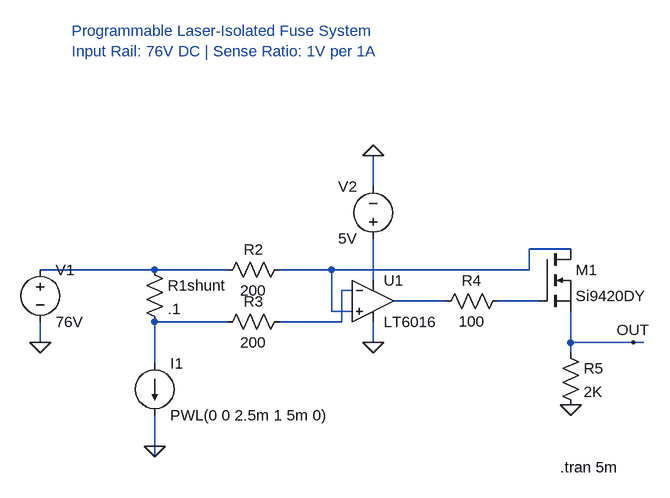
[diagram p0: schematic Project1_76V_Fuse.asc]
Project1_76V_Fuse.asc, the LTspice schematic file:
Version 4
SHEET 1 1008 800
WIRE 480 160 480 112
WIRE 784 256 720 256
WIRE 144 288 -32 288
WIRE 256 288 144 288
WIRE 416 288 336 288
WIRE 720 288 720 256
WIRE 720 288 416 288
WIRE 480 304 480 240
WIRE 448 320 432 320
WIRE 592 336 512 336
WIRE 736 336 672 336
WIRE 416 352 416 288
WIRE 448 352 416 352
WIRE 256 368 144 368
WIRE 432 368 432 320
WIRE 432 368 336 368
WIRE -32 400 -32 368
WIRE 480 400 480 368
WIRE 784 400 784 352
WIRE 880 400 784 400
WIRE 896 400 880 400
WIRE 784 416 784 400
WIRE 144 432 144 368
WIRE 144 560 144 512
WIRE 144 576 144 560
FLAG -32 400 0
FLAG 144 560 0
FLAG 480 400 0
FLAG 480 112 0
FLAG 880 400 OUT
FLAG 784 496 0
SYMBOL voltage -32 272 R0
SYMATTR InstName V1
SYMATTR Value 76V
SYMBOL res 128 272 R0
SYMATTR InstName R1shunt
SYMATTR Value .1
SYMBOL res 352 272 R90
WINDOW 0 0 56 VBottom 2
WINDOW 3 32 56 VTop 2
SYMATTR InstName R2
SYMATTR Value 200
SYMBOL res 352 352 R90
WINDOW 0 0 56 VBottom 2
WINDOW 3 32 56 VTop 2
SYMATTR InstName R3
SYMATTR Value 200
SYMBOL load2 144 432 R0
SYMATTR InstName I1
SYMATTR Value PWL(0 0 2.5m 1 5m 0)
SYMBOL OpAmps/LT6016 480 336 R0
SYMATTR InstName U1
SYMBOL voltage 480 256 R180
WINDOW 0 24 96 Left 2
WINDOW 3 24 16 Left 2
SYMATTR InstName V2
SYMATTR Value 5V
SYMBOL res 576 352 R270
WINDOW 0 32 56 VTop 2
WINDOW 3 0 56 VBottom 2
SYMATTR InstName R4
SYMATTR Value 100
SYMBOL nmos 736 256 R0
SYMATTR InstName M1
SYMATTR Value Si9420DY
SYMBOL res 768 400 R0
SYMATTR InstName R5
SYMATTR Value 2K
TEXT 768 592 Left 2 !.tran 5m
TEXT 16 -80 Left 2 ;Programmable Laser-Isolated Fuse System\nInput Rail: 76V DC | Sense Ratio: 1V per 1A

The netlist it stands for:
* Project1_76V_Fuse.asc
V1 N002 0 76V
R1shunt N002 N007 .1
R2 N001 N002 200
R3 N004 N007 200
I1 N007 0 PWL(0 0 2.5m 1 5m 0)
* U1: LT6016 (symbol OpAmps/LT6016 not available, pins judged from their places): In+=N001 In-=N004 V+=N003 V-=0 OUT=N005
V2 N003 0 5V
R4 N005 N006 100
M1 N001 N006 OUT OUT Si9420DY
R5 OUT 0 2K
.model NMOS NMOS
.model PMOS PMOS
.lib standard.mos
.tran 5m
* Programmable Laser-Isolated Fuse System
* Input Rail: 76V DC | Sense Ratio: 1V per 1A
.backanno
.end